# EAGLE schematic Exoskeleton_PCB_v1 (EAGLE 9.6.2)
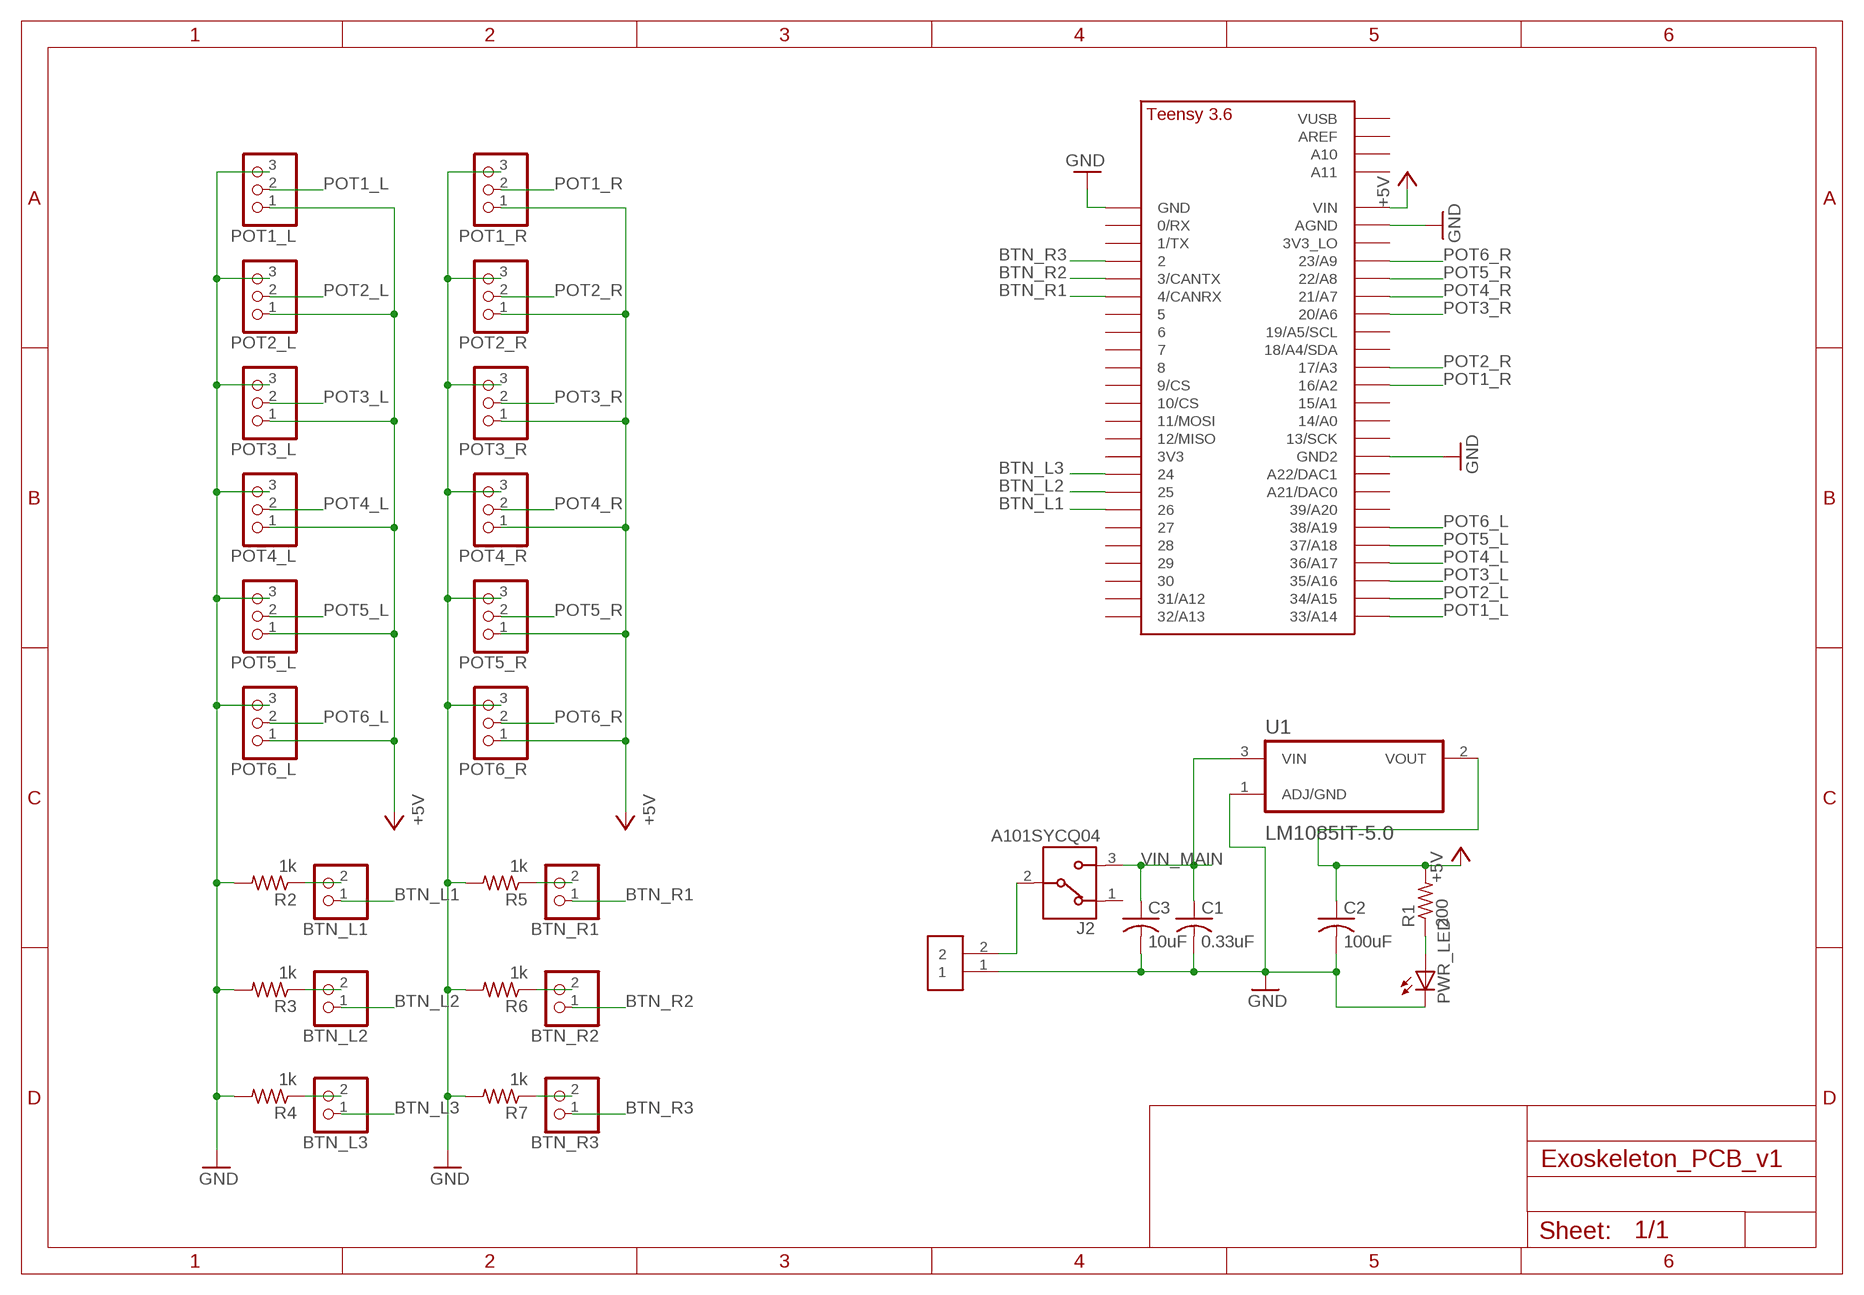
[diagram p0: schematic, sheet 1]

## Parts
BTN_L1  PINHD-1X2  [1X02]
BTN_L2  PINHD-1X2  [1X02]
BTN_L3  PINHD-1X2  [1X02]
BTN_R1  PINHD-1X2  [1X02]
BTN_R2  PINHD-1X2  [1X02]
BTN_R3  PINHD-1X2  [1X02]
C1  0.33uF  C-US050-030X075  [C050-030X075]
C2  100uF  C-US050-030X075  [C050-030X075]
C3  10uF  C-US050-030X075  [C050-030X075]
J1  282837-2  [TE_282837-2]
J2  A101SYCQ04  [TE_A101SYCQ04]
POT1_L  PINHD-1X3  [1X03]
POT1_R  PINHD-1X3  [1X03]
POT2_L  PINHD-1X3  [1X03]
POT2_R  PINHD-1X3  [1X03]
POT3_L  PINHD-1X3  [1X03]
POT3_R  PINHD-1X3  [1X03]
POT4_L  PINHD-1X3  [1X03]
POT4_R  PINHD-1X3  [1X03]
POT5_L  PINHD-1X3  [1X03]
POT5_R  PINHD-1X3  [1X03]
POT6_L  PINHD-1X3  [1X03]
POT6_R  PINHD-1X3  [1X03]
PWR_LED  LED5MM  [LED5MM]
R1  200  R-US_0207/9  [0207/9]
R2  1k  R-US_0207/9  [0207/9]
R3  1k  R-US_0207/9  [0207/9]
R4  1k  R-US_0207/9  [0207/9]
R5  1k  R-US_0207/9  [0207/9]
R6  1k  R-US_0207/9  [0207/9]
R7  1k  R-US_0207/9  [0207/9]
U1  LM1085IT-5.0  [TO254P1054X470X1955-3]
U$1  TEENSY_3.5/3.6_BASIC  [TEENSY_3.5/3.6_BASIC]

## Nets
+5V [PWR]: C2.1 POT1_L.1 POT1_R.1 POT2_L.1 POT2_R.1 POT3_L.1 POT3_R.1 POT4_L.1 POT4_R.1 POT5_L.1 POT5_R.1 POT6_L.1 POT6_R.1 R1.2 U1.2(VOUT) U$1.VIN
BTN_L1: BTN_L1.1 U$1.26
BTN_L2: BTN_L2.1 U$1.25
BTN_L3: BTN_L3.1 U$1.24
BTN_R1: BTN_R1.1 U$1.4/CANRX
BTN_R2: BTN_R2.1 U$1.3/CANTX
BTN_R3: BTN_R3.1 U$1.2
GND: C1.2 C2.2 C3.2 J1.1 POT1_L.3 POT1_R.3 POT2_L.3 POT2_R.3 POT3_L.3 POT3_R.3 POT4_L.3 POT4_R.3 POT5_L.3 POT5_R.3 POT6_L.3 POT6_R.3 PWR_LED.K(C) R2.2 R3.2 R4.2 R5.2 R6.2 R7.2 U1.1(ADJ/GND) U$1.AGND U$1.GND U$1.GND2
N$1: PWR_LED.A R1.1
N$2: BTN_L1.2 R2.1
N$3: BTN_L3.2 R4.1
N$4: BTN_L2.2 R3.1
N$5: BTN_R1.2 R5.1
N$6: BTN_R2.2 R6.1
N$7: BTN_R3.2 R7.1
N$8: J1.2 J2.2
POT1_L: POT1_L.2 U$1.33/A14
POT1_R: POT1_R.2 U$1.16/A2
POT2_L: POT2_L.2 U$1.34/A15
POT2_R: POT2_R.2 U$1.17/A3
POT3_L: POT3_L.2 U$1.35/A16
POT3_R: POT3_R.2 U$1.20/A6
POT4_L: POT4_L.2 U$1.36/A17
POT4_R: POT4_R.2 U$1.21/A7
POT5_L: POT5_L.2 U$1.37/A18
POT5_R: POT5_R.2 U$1.22/A8
POT6_L: POT6_L.2 U$1.38/A19
POT6_R: POT6_R.2 U$1.23/A9
VIN_MAIN: C1.1 C3.1 J2.3 U1.3(VIN)
Unconnected: J2.1 U$1.0/RX U$1.1/TX U$1.3V3 U$1.3V3_LO U$1.5 U$1.6 U$1.7 U$1.8 U$1.9/CS U$1.10/CS U$1.11/MOSI U$1.12/MISO U$1.13/SCK U$1.14/A0 U$1.15/A1 U$1.18/A4/SDA U$1.19/A5/SCL U$1.21/DAC0(A21/DAC0) U$1.27 U$1.28 U$1.29 U$1.30 U$1.31/A12 U$1.32/A13 U$1.39/A20 U$1.A10 U$1.A11 U$1.A22/DAC1 U$1.AREF U$1.VUSB

## Library data of the parts
BTN_L1-BTN_L3 BTN_R1-BTN_R3 = pinhead:PINHD-1X2: PIN HEADER
C1-C3 = adafruit:C-US: CAPACITOR, American symbol
J1 = 282837-2:282837-2: TERM BLOCK 5.08MM 2POS SIDE ENTY; AVAILABILITY: Unavailable; COMMENT: 282837-2; DESCRIPTION: Connector Terminal Blocks Receptacle 2 Position 5.08mm Solder Straight Thru-Hole 13.5A/Contact; MF: TE Connectivity; MP: 282837-2; PACKAGE: None; PRICE: None; TE_PURCHASE_URL: https://www.te.com/usa-en/product-282837-2.html?te_bu=Cor&te_type=disp&te_campaign=seda_glo_cor-seda-global-disp-prtnr-fy19-seda-model-bom-cta_sma-317_1&elqCampaignId=32493
J2 = A101SYCQ04:A101SYCQ04: Switch Toggle ON None ON SPDT Long Baton Lever PC Pins 5A 250VAC 28VDC PC Mount with Threads Bulk Check prices <https://snapeda.com/parts/A101SYCQ04/TE%20Connectivity/view-part/?ref=eda>; AVAILABILITY: Warning; COMMENT: 4-1825136-5; DESCRIPTION: Toggle Switch SPDT Panel Mount; MF: TE Connectivity; MOUSER-PURCHASE-URL: https://snapeda.com/shop?store=Mouser&id=293772; MP: A101SYCQ04; PACKAGE: SOIC-8 TE Connectivity; PRICE: None
POT1_L POT1_R POT2_L POT2_R POT3_L POT3_R POT4_L POT4_R POT5_L POT5_R POT6_L POT6_R = pinhead:PINHD-1X3: PIN HEADER
PWR_LED = adafruit:LED: LED OSRAM: - CHIPLED LG R971, LG N971, LY N971, LG Q971, LY Q971, LO R971, LY R971 LH N974, LH R974 LS Q976, LO Q976, LY Q976 LO Q996 - Hyper CHIPLED LW Q18S LB Q993, LB Q99A, LB R99A - SideLED LS A670, LO A670, LY A670, LG A670, LP A670 LB A673, LV A673, LT A673, LW A673 LH A674 LY A675 LS A676, LA A676, LO A676, LY A676, LW A676 LS A679, LY A679, LG A679 - Hyper Micro SIDELED® LS Y876, LA Y876, LO Y876, LY Y876 LT Y87S - SmartLED LW L88C, LW L88S LB L89C, LB L89S, LG L890 LS L89K, LO L89K, LY L89K LS L896, LA L896, LO L896, LY L896 - TOPLED LS T670, LO T670, LY T670, LG T670, LP T670 LSG T670, LSP T670, LSY T670, LOP T670, LYG T670 LG T671, LOG T671, LSG T671 LB T673, LV T673, LT T673, LW T673 LH T674 LS T676, LA T676, LO T676, LY T676, LB T676, LH T676, LSB T676, LW T676 LB T67C, LV T67C, LT T67C, LS T67K, LO T67K, LY T67K, LW E67C LS E67B, LA E67B, LO E67B, LY E67B, LB E67C, LV E67C, LT E67C LW T67C LS T679, LY T679, LG T679 LS T770, LO T770, LY T770, LG T770, LP T770 LB T773, LV T773, LT T773, LW T773 LH T774 LS E675, LA E675, LY E675, LS T675 LS T776, LA T776, LO T776, LY T776, LB T776 LHGB T686 LT T68C, LB T68C - Hyper Mini TOPLED® LB M676 - Mini TOPLED Santana® LG M470 LS M47K, LO M47K, LY M47K Source: http://www.osram.convergy.de/
R1-R7 = adafruit:R-US_: RESISTOR, American symbol
U1 = LM1085IT-5.0:LM1085IT-5.0: Check prices <https://pricing.snapeda.com/search/part/LM1085IT-5.0/NOPB/?ref=eda>; AVAILABILITY: Good; DESCRIPTION: 3-A, 29-V, linear voltage regulator 3-TO-220 -40 to 125; MF: Texas Instruments; MP: LM1085IT-5.0/NOPB; PACKAGE: TO-220-3 Texas Instruments; PRICE: None; PURCHASE-URL: https://pricing.snapeda.com/search/part/LM1085IT-5.0/NOPB/?ref=eda
U$1 = Teensy356:TEENSY_3.5/3.6_BASIC

## Net classes
0 default: width 0.254 mm
1 PWR: width 1.27 mm, clearance 0.254 mm